# Altium project chibu_project_circuit2.PrjPcb
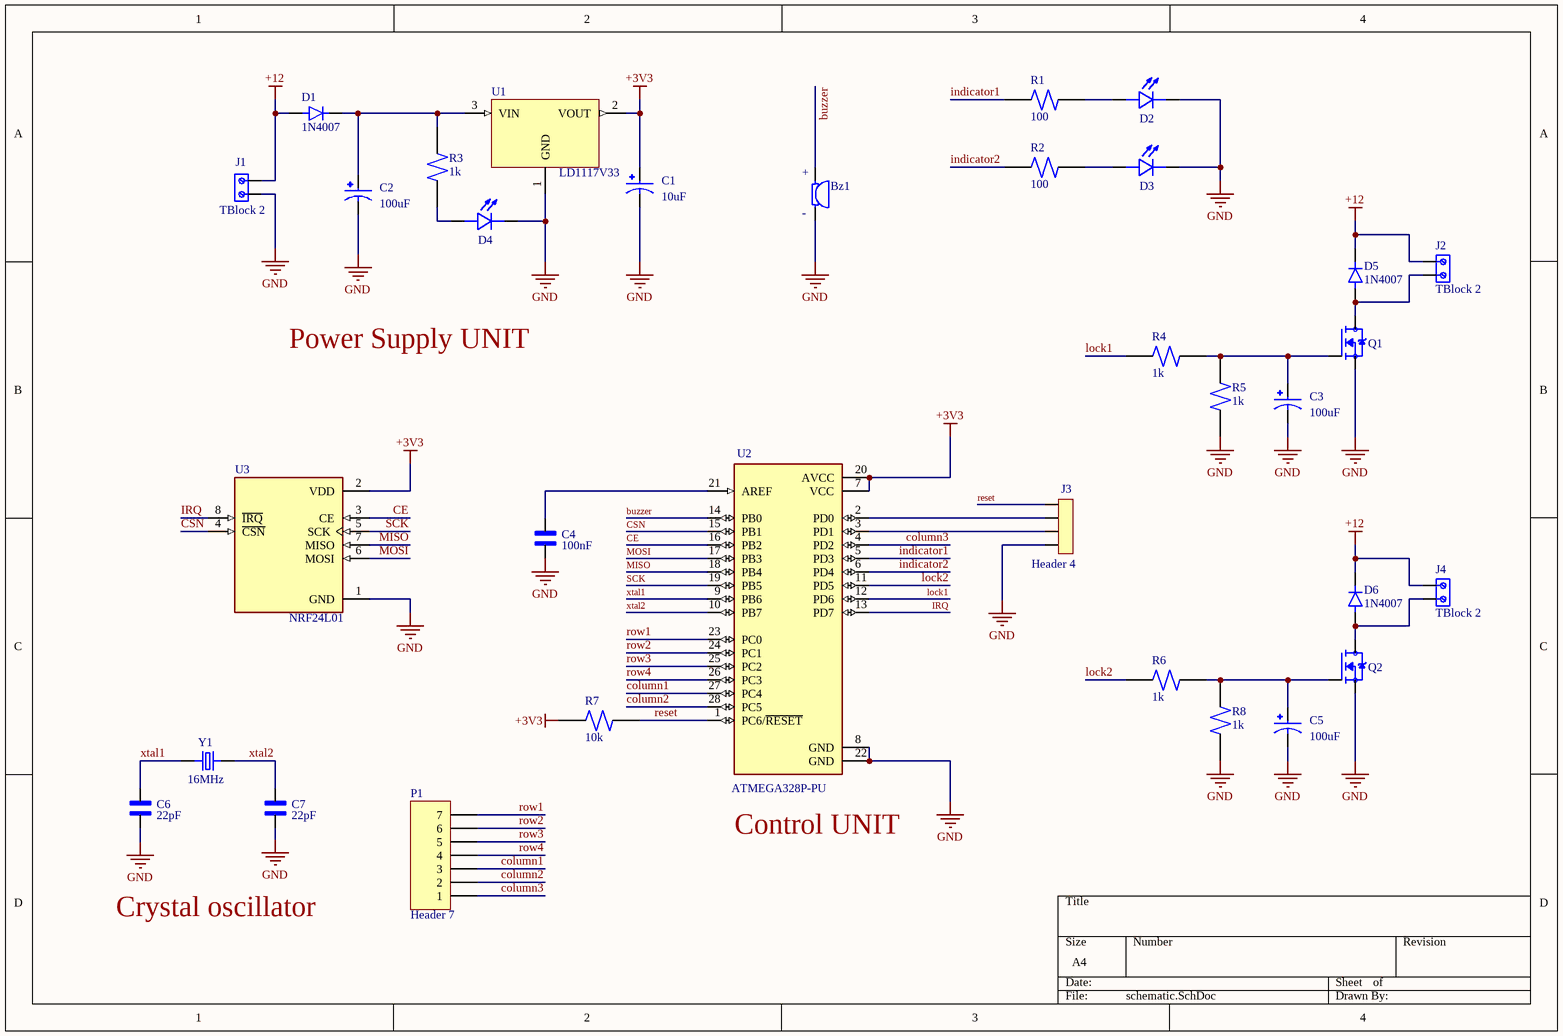
[diagram p0: schematic.SchDoc]
1 sheet, 33 parts. Net scope: global (net labels, ports and power ports of the same name join across sheets).
Board file: PCB_layout.PcbDoc

## Sheet schematic.SchDoc
size A4; SheetNumber: 1; SheetTotal: 1

### Parts
Bz1  AI-1223-TWT-12V-R  [XDCR_AI-1223-TWT-12V-R]  (value not drawn)
C1  10uF  [CAPPRD500W50D500H1100]
C2  100uF  [CAPPRD500W50D500H1100]
C3  100uF  [CAPPRD500W50D500H1100]
C4  100nF  [CAPRB500W50L450T300H550]
C5  100uF  [CAPPRD500W50D500H1100]
C6  22pF  [CAPRB500W50L450T300H550]
C7  22pF  [CAPRB500W50L450T300H550]
D1  1N4007  [DIOAD1060W80L520D270]
D2  L08R5000Q1  [LEDRD254W57D500H1070]  (value not drawn)
D3  L08R5000Q1  [LEDRD254W57D500H1070]  (value not drawn)
D4  L08R5000Q1  [LEDRD254W57D500H1070]  (value not drawn)
D5  1N4007  [DIOAD1060W80L520D270]
D6  1N4007  [DIOAD1060W80L520D270]
J1  TBlock 2  [691111710002]
J2  TBlock 2  [691111710002]
J3  Header 4  [SULLINS_PPTC041LFBN-RC]
J4  TBlock 2  [691111710002]
P1  Header 7  [HDR1X7]
Q1  N-Channel mosfet  [TO254P1052X465X1989-3]  (value not drawn)
Q2  N-Channel mosfet  [TO254P1052X465X1989-3]  (value not drawn)
R1  100  [RESAD1100W55L680D260]
R2  100  [RESAD1100W55L680D260]
R3  1k  [RESAD1100W55L680D260]
R4  1k  [RESAD1100W55L680D260]
R5  1k  [RESAD1100W55L680D260]
R6  1k  [RESAD1100W55L680D260]
R7  10k  [RESAD1100W55L680D260]
R8  1k  [RESAD1100W55L680D260]
U1  LD1117V33  [TO255P1020X450X1968-3]
U2  ATMEGA328P-PU  [DIP794W46P254L2967H457Q28B]
U3  NRF24L01  [XCVR_NRF24L01P-MODULE-PCB]
Y1  16MHz  [XTAL_ECS-160-20-4X]

### Nets
+3V3: C1.P R7.2 U1.2(VOUT) U2.7(VCC) U2.20(AVCC) U3.2(VDD)
+12: D1.A D5.C D6.C J1.2 J2.1 J4.1
GND: Bz1.N(NEG) C1.N C2.N C3.N C4.2 C5.N C6.2 C7.2 D2.C D3.C D4.C J1.1 J3.1 Q1.3(S) Q2.3(S) R5.1 R8.1 U1.1(GND) U2.8(GND) U2.22(GND) U3.1(GND)
buzzer: Bz1.P(POS) U2.14(PB0)
CE: U2.16(PB2) U3.3(CE)
column1: P1.3 U2.27(PC4)
column2: P1.2 U2.28(PC5)
column3: P1.1 U2.4(PD2)
CSN: U2.15(PB1) U3.4(~{CSN})
indicator1: R1.2 U2.5(PD3)
indicator2: R2.2 U2.6(PD4)
IRQ: U2.13(PD7) U3.8(~{IRQ})
lock1: R4.2 U2.12(PD6)
lock2: R6.2 U2.11(PD5)
MISO: U2.18(PB4) U3.7(MISO)
MOSI: U2.17(PB3) U3.6(MOSI)
reset: J3.4 R7.1 U2.1(PC6/~{RESET})
row1: P1.7 U2.23(PC0)
row2: P1.6 U2.24(PC1)
row3: P1.5 U2.25(PC2)
row4: P1.4 U2.26(PC3)
SCK: U2.19(PB5) U3.5(SCK)
xtal1: C6.1 U2.9(PB6) Y1.1
xtal2: C7.1 U2.10(PB7) Y1.2
NetC2_P: C2.P D1.C R3.2 U1.3(VIN)
NetC3_P: C3.P Q1.1(G) R4.1 R5.2
NetC4_1: C4.1 U2.21(AREF)
NetC5_P: C5.P Q2.1(G) R6.1 R8.2
NetD2_A: D2.A R1.1
NetD3_A: D3.A R2.1
NetD4_A: D4.A R3.1
NetD5_A: D5.A J2.2 Q1.2(D)
NetD6_A: D6.A J4.2 Q2.2(D)
NetJ3_2: J3.2 U2.3(PD1)
NetJ3_3: J3.3 U2.2(PD0)

### Notes on the sheet
- Power Supply UNIT
- (near U2) Control UNIT
- Crystal oscillator
- (in symbol Buzzer) +; -

### Library data of the parts
Bz1 = Buzzer: ELECTRO-MECHANICAL AUDIO INDICATOR; MF: PUI Audio,; Availability: In Stock; Package: 2225 PUI Audio; Value: *; Price: None; MP: AI-1223-TWT-12V-R; Purchase-URL: https://pricing.snapeda.com/search/part/AI-1223-TWT-12V-R/?ref=eda
C1-C3 C5 = Electrolytic capacitor: FS-A; MF: {'manufacturer': u'Panasonic'}; MP: EEUFS0J221B; Package: None; Value: *; Availability: Unavailable; Price: None
C4 C6 C7 = Ceramic capacitor: 2200 pF Â±10% 250V Ceramic Capacitor X7R Radial; MF: TDK; MP: FG24X7R2E222KNT06; Digi-Key_Part_Number: 445-173386-1-ND; Purchase-URL: https://pricing.snapeda.com/search/part/FG24X7R2E222KNT06/?ref=eda; Check_prices: https://www.snapeda.com/parts/FG24X7R2E222KNT06/TDK/view-part/?ref=eda; Value: *; Package: Radial TDK; SnapEDA_Link: https://www.snapeda.com/parts/FG24X7R2E222KNT06/TDK/view-part/?ref=snap
D1 D5 D6 = 1N4007: Diode Switching 1KV 1A 2-Pin DO-41; Price: None; MP: 1N4007; Value: *; Availability: Unavailable; Package: None
D2-D4 = LED: LED, Orange, Through Hole, T-1 3/4 (5mm), 30 mA, 2.1 V, 635 nm; MF: {'manufacturer': u'LED Technology'}; Price: None; Package: None; Availability: Unavailable; MP: L08R5000Q1; Value: *
J1 J2 J4 = Terminal Block - 2Pins: 2 Position Wire to Board Terminal Block Horizontal with Board 0.197 _5.00mm_ Through Hole; MF: Wurth Electronics; Value: *; Availability: Unavailable; MP: 691111710002; Price: None; Package: None; SnapEDA_Link: https://www.snapeda.com/parts/691111710002/Wurth%20Electronics%20Inc./view-part/1195092/?ref=snap
J3 = Female header - 4Pins: 4 Position Header Connector Through Hole; MP: PPTC041LFBN-RC; MF: Sullins Connector; Value: *; SnapEDA_Link: https://www.snapeda.com/parts/PPTC041LFBN-RC/Sullins%20Connector%20Solutions/view-part/285917/?ref=snap; Package: None; Availability: Warning; Check_prices: https://www.snapeda.com/parts/PPTC041LFBN-RC/Sullins%20Connector%20Solutions/view-part/285917/?ref=eda; Price: None; Purchase-URL: https://pricing.snapeda.com/search/part/PPTC041LFBN-RC/?ref=eda
P1 = Header 7: Header, 7-Pin; LatestRevisionDate: 17-Jul-2002; LatestRevisionNote: Re-released for DXP Platform.; Publisher: Altium Limited
Q1 Q2 = IRF540: N-Channel 100V 22A (Tc) 85W (Tc) Through Hole TO-220AB; Value: *; MP: IRF540; Package: None; Availability: Unavailable; Price: None
R1-R8 = Resistor (0.25W): (MFR-25FBF52-10K) 10,2 kOhm bei 1% 0,25W, 1/4W Durchbohrlochwiderstand Axial Metal Film; MF: Yageo; Digi-Key_Part_Number: 10.2KXBK-ND; SnapEDA_Link: https://www.snapeda.com/parts/MFR-25FBF52-10K/Yageo/view-part/424333/?ref=snap; Package: Axial Yageo; Purchase-URL: https://pricing.snapeda.com/search/part/MFR-25FBF52-10K/?ref=eda; MP: MFR-25FBF52-10K; Value: *
U2 = ATMEGA328P-PU: ATmega Series 20 MHz 32 KB Flash 2 KB SRAM 8-Bit Microcontroller - DIP-28; Value: *; MP: ATMEGA328P-PU; Package: None; Availability: Unavailable; Price: None
U3 = NRF24L01P-MODULE-PCB: - Transceiver For Use With nRF24L01+; MF: Nordic Semiconductor; Package: None; MP: NRF24L01P-MODULE-PCB; Value: *; Availability: Bad; Price: None; SnapEDA_Link: https://www.snapeda.com/parts/NRF24L01P-MODULE-PCB/Nordic%20Semiconductor%20ASA/view-part/230534/?ref=snap; Mouser-Purchase-URL: https://snapeda.com/shop?store=Mouser&id=230534
Y1 = Crystal oscilator: CRYSTAL T/H; MF: {'manufacturer': u'ECS Inc.'}; MP: ECS-160-S-4; Package: None; Value: *; Availability: Unavailable; Price: None
U1 = LD1117V33: Package: None; MP: LD1117V33; Price: None; Availability: Unavailable; Value: *